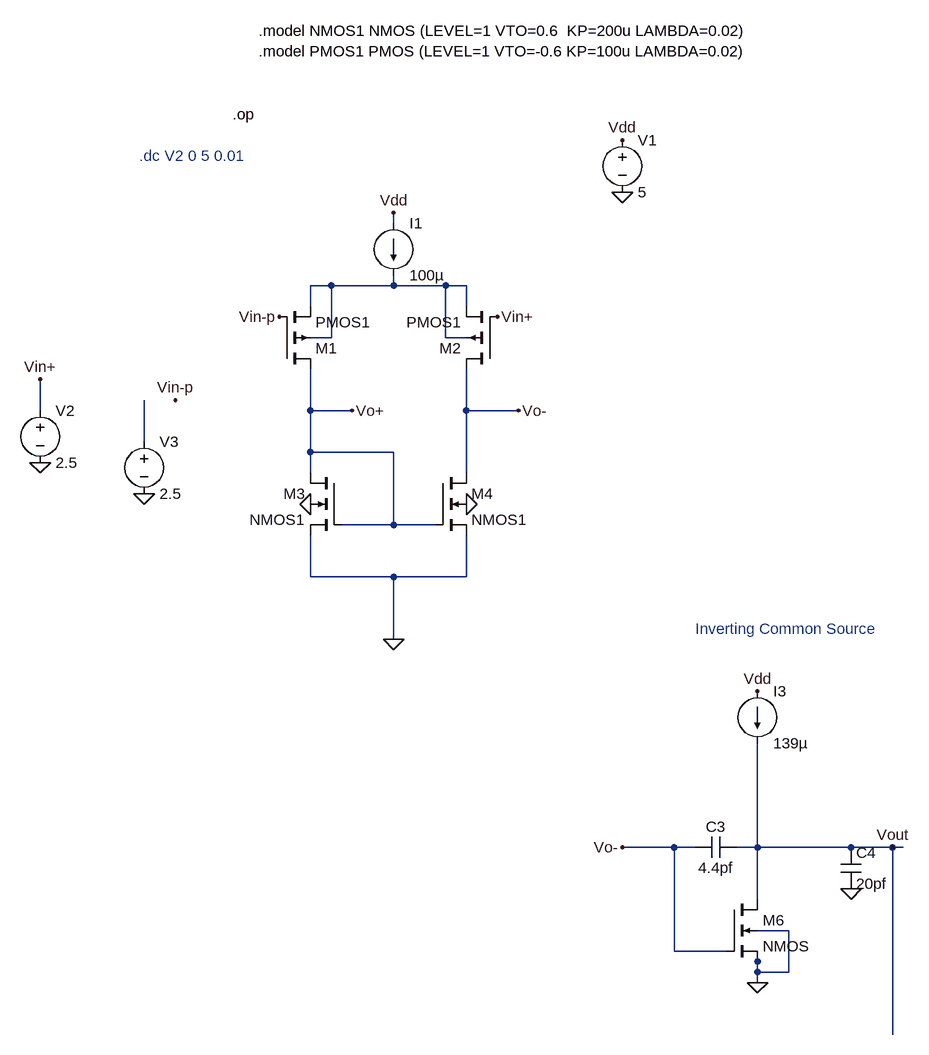
[diagram p0: schematic PMOS_diff_pair.asc]
PMOS_diff_pair.asc, the LTspice schematic file:
Version 4.1
SHEET 1 936 1212
WIRE -176 -144 -176 -160
WIRE -272 -48 -304 -48
WIRE -176 -48 -176 -64
WIRE -176 -48 -272 -48
WIRE -96 -48 -176 -48
WIRE -64 -48 -96 -48
WIRE -304 -16 -304 -48
WIRE -64 -16 -64 -48
WIRE -272 32 -272 -48
WIRE -272 32 -304 32
WIRE -96 32 -96 -48
WIRE -64 32 -96 32
WIRE -720 144 -720 96
WIRE -304 144 -304 80
WIRE -240 144 -304 144
WIRE -64 144 -64 80
WIRE 16 144 -64 144
WIRE -560 192 -560 128
WIRE -304 208 -304 144
WIRE -176 208 -304 208
WIRE -304 240 -304 208
WIRE -64 240 -64 144
WIRE -176 320 -176 208
WIRE -176 320 -256 320
WIRE -112 320 -176 320
WIRE -304 400 -304 336
WIRE -176 400 -304 400
WIRE -64 400 -64 336
WIRE -64 400 -176 400
WIRE -176 496 -176 400
WIRE 256 816 176 816
WIRE 288 816 256 816
WIRE 384 816 384 656
WIRE 384 816 352 816
WIRE 528 816 384 816
WIRE 592 816 528 816
WIRE 608 816 592 816
WIRE 384 896 384 816
WIRE 432 944 384 944
WIRE 256 976 256 816
WIRE 336 976 256 976
WIRE 384 992 384 976
WIRE 384 1008 384 992
WIRE 432 1008 432 944
WIRE 432 1008 384 1008
WIRE 384 1024 384 1008
WIRE 592 1104 592 816
FLAG -176 -160 Vdd
FLAG -176 496 0
FLAG -64 288 0
FLAG -304 288 0
FLAG -16 0 Vin+
FLAG -352 0 Vin-p
FLAG -720 224 0
FLAG -720 96 Vin+
FLAG 176 -192 0
FLAG 176 -272 Vdd
FLAG -240 144 Vo+
FLAG -560 272 0
FLAG 384 576 Vdd
FLAG 528 880 0
FLAG 384 1024 0
FLAG 592 816 Vout
FLAG 16 144 Vo-
FLAG -512 128 Vin-p
FLAG 176 816 Vo-
DATAFLAG -304 160 ""
DATAFLAG -240 -48 ""
DATAFLAG -48 144 ""
SYMBOL pmos4 -352 80 M180
SYMATTR InstName M1
SYMATTR Value PMOS1
SYMATTR Value2 l=300n w=900n
SYMBOL pmos4 -16 80 R180
SYMATTR InstName M2
SYMATTR Value PMOS1
SYMATTR Value2 l=300n w=900n
SYMBOL current -176 -144 R0
WINDOW 123 0 0 Left 0
WINDOW 39 0 0 Left 0
SYMATTR InstName I1
SYMATTR Value 100µ
SYMBOL nmos4 -256 240 M0
SYMATTR InstName M3
SYMATTR Value NMOS1
SYMATTR Value2 l=300n w=300n
SYMBOL nmos4 -112 240 R0
SYMATTR InstName M4
SYMATTR Value NMOS1
SYMATTR Value2 l=300n w=300n
SYMBOL voltage -720 128 R0
WINDOW 123 0 0 Left 0
WINDOW 39 0 0 Left 0
SYMATTR InstName V2
SYMATTR Value 2.5
SYMBOL voltage 176 -288 R0
WINDOW 123 0 0 Left 0
WINDOW 39 0 0 Left 0
SYMATTR InstName V1
SYMATTR Value 5
SYMBOL voltage -560 176 R0
WINDOW 123 0 0 Left 0
WINDOW 39 0 0 Left 0
SYMATTR InstName V3
SYMATTR Value 2.5
SYMBOL cap 352 800 R90
WINDOW 0 0 32 VBottom 2
WINDOW 3 32 32 VTop 2
SYMATTR InstName C3
SYMATTR Value 4.4pf
SYMBOL cap 512 816 R0
SYMATTR InstName C4
SYMATTR Value 20pf
SYMBOL current 384 576 R0
WINDOW 123 0 0 Left 0
WINDOW 39 0 0 Left 0
SYMATTR InstName I3
SYMATTR Value 139µ
SYMBOL nmos4 336 896 R0
SYMATTR InstName M6
TEXT -424 -312 Left 2 !.op
TEXT -384 -440 Left 2 !.model NMOS1 NMOS (LEVEL=1 VTO=0.6  KP=200u LAMBDA=0.02)\n.model PMOS1 PMOS (LEVEL=1 VTO=-0.6 KP=100u LAMBDA=0.02)
TEXT -568 -248 Left 2 ;.dc V2 0 5 0.01
TEXT 288 480 Left 2 ;Inverting Common Source

The netlist it stands for:
* PMOS_diff_pair.asc
M1 Vo+ Vin-p N001 N001 PMOS1 l=300n w=900n
M2 Vo- Vin+ N001 N001 PMOS1 l=300n w=900n
I1 Vdd N001 100µ
M3 Vo+ Vo+ 0 0 NMOS1 l=300n w=300n
M4 Vo- Vo+ 0 0 NMOS1 l=300n w=300n
V2 Vin+ 0 2.5
V1 Vdd 0 5
V3 N002 0 2.5
C3 Vout Vo- 4.4pf
C4 Vout 0 20pf
I3 Vdd Vout 139µ
M6 Vout Vo- 0 0 NMOS
.model NMOS NMOS
.model PMOS PMOS
.lib standard.mos
.op
.model NMOS1 NMOS (LEVEL=1 VTO=0.6  KP=200u LAMBDA=0.02)
.model PMOS1 PMOS (LEVEL=1 VTO=-0.6 KP=100u LAMBDA=0.02)
* .dc V2 0 5 0.01
* Inverting Common Source
.backanno
.end